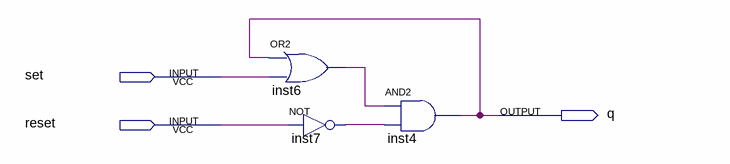
[diagram p0: schematic sheet]
// Quartus schematic myLatch.bdf as structural Verilog: 3 symbols, 3 pins
module myLatch (
  input  set,
  input  reset,
  output q
);

  wire inst6_out, inst7_out;

  or inst6 (inst6_out, q, set);
  not inst7 (inst7_out, reset);
  and inst4 (q, inst6_out, inst7_out);
endmodule
